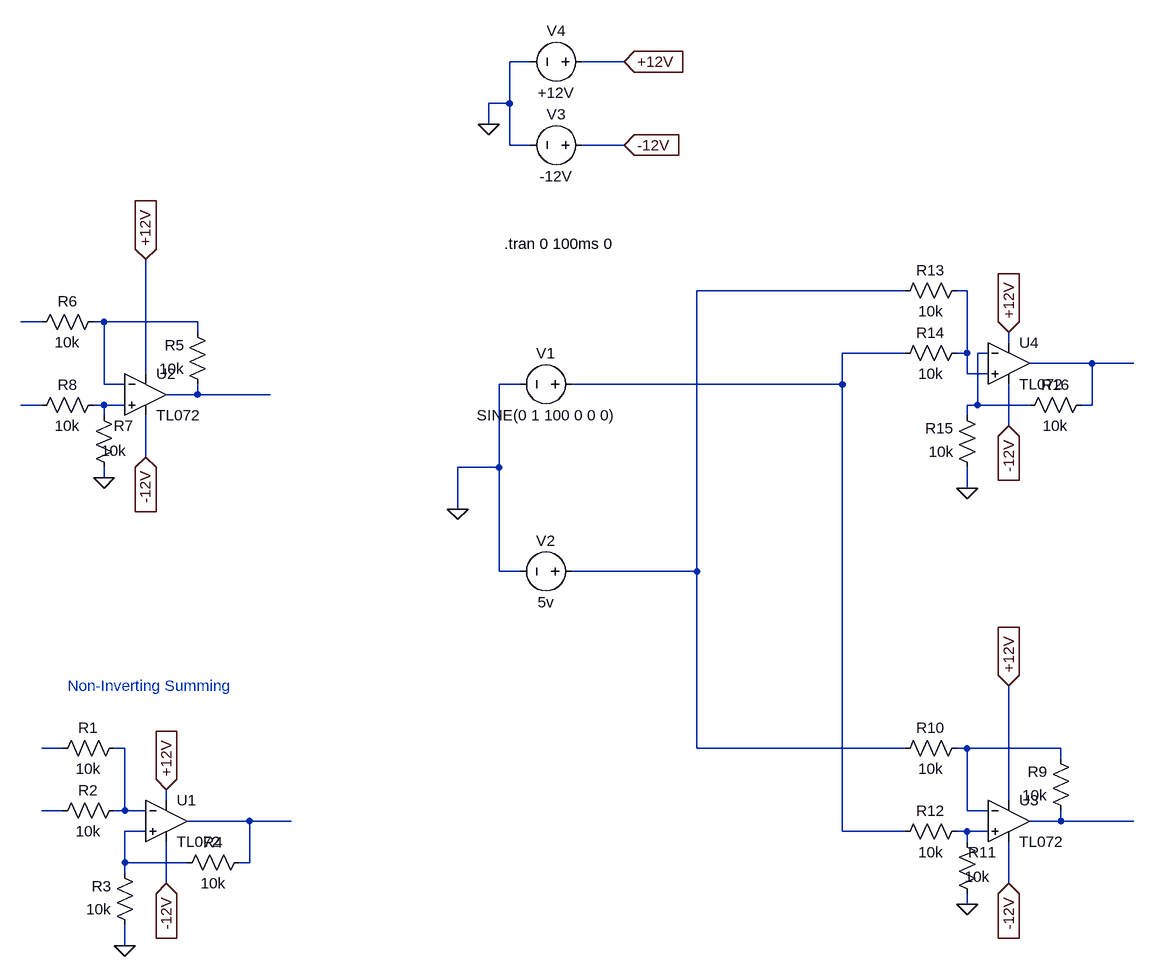
[diagram p0: schematic op-amp-patterns.asc]
op-amp-patterns.asc, the LTspice schematic file:
Version 4
SHEET 1 1412 680
WIRE 480 -960 448 -960
WIRE 624 -960 560 -960
WIRE 448 -896 448 -960
WIRE 448 -896 416 -896
WIRE 416 -864 416 -896
WIRE 448 -832 448 -896
WIRE 480 -832 448 -832
WIRE 624 -832 560 -832
WIRE 1056 -608 736 -608
WIRE 1152 -608 1136 -608
WIRE -272 -560 -304 -560
WIRE -176 -560 -192 -560
WIRE -32 -560 -176 -560
WIRE -32 -544 -32 -560
WIRE 1216 -528 1216 -544
WIRE 1056 -512 960 -512
WIRE 1152 -512 1152 -608
WIRE 1152 -512 1136 -512
WIRE 1184 -512 1168 -512
WIRE 1344 -496 1248 -496
WIRE 1408 -496 1344 -496
WIRE -112 -480 -112 -656
WIRE 1152 -480 1152 -512
WIRE 1184 -480 1152 -480
WIRE -176 -464 -176 -560
WIRE -144 -464 -176 -464
WIRE 464 -464 432 -464
WIRE 960 -464 960 -512
WIRE 960 -464 544 -464
WIRE -32 -448 -32 -464
WIRE -32 -448 -80 -448
WIRE 80 -448 -32 -448
WIRE -272 -432 -304 -432
WIRE -176 -432 -192 -432
WIRE -144 -432 -176 -432
WIRE 1168 -432 1168 -512
WIRE 1168 -432 1152 -432
WIRE 1248 -432 1168 -432
WIRE 1344 -432 1344 -496
WIRE 1344 -432 1328 -432
WIRE -176 -416 -176 -432
WIRE 1152 -416 1152 -432
WIRE 1216 -400 1216 -464
WIRE -112 -352 -112 -416
WIRE 432 -336 432 -464
WIRE 432 -336 368 -336
WIRE -176 -320 -176 -336
WIRE 1152 -304 1152 -336
WIRE 368 -272 368 -336
WIRE 432 -176 432 -336
WIRE 464 -176 432 -176
WIRE 736 -176 736 -608
WIRE 736 -176 544 -176
WIRE -240 96 -272 96
WIRE -144 96 -160 96
WIRE 736 96 736 -176
WIRE 1056 96 736 96
WIRE 1152 96 1136 96
WIRE 1296 96 1152 96
WIRE 1296 112 1296 96
WIRE -80 176 -80 160
WIRE 1216 176 1216 0
WIRE -240 192 -272 192
WIRE -144 192 -144 96
WIRE -144 192 -160 192
WIRE -112 192 -144 192
WIRE 1152 192 1152 96
WIRE 1184 192 1152 192
WIRE 48 208 -48 208
WIRE 112 208 48 208
WIRE 1296 208 1296 192
WIRE 1296 208 1248 208
WIRE 1408 208 1296 208
WIRE -112 224 -144 224
WIRE 960 224 960 -464
WIRE 1056 224 960 224
WIRE 1152 224 1136 224
WIRE 1184 224 1152 224
WIRE 1152 240 1152 224
WIRE -144 272 -144 224
WIRE -48 272 -144 272
WIRE 48 272 48 208
WIRE 48 272 32 272
WIRE -144 288 -144 272
WIRE -80 304 -80 240
WIRE 1216 304 1216 240
WIRE 1152 336 1152 320
WIRE -144 400 -144 368
FLAG -80 160 +12V
IOPIN -80 160 In
FLAG -80 304 -12V
IOPIN -80 304 In
FLAG -144 400 0
FLAG -112 -656 +12V
IOPIN -112 -656 In
FLAG -112 -352 -12V
IOPIN -112 -352 In
FLAG -176 -320 0
FLAG 1216 0 +12V
IOPIN 1216 0 In
FLAG 1216 304 -12V
IOPIN 1216 304 In
FLAG 1152 336 0
FLAG 1216 -544 +12V
IOPIN 1216 -544 In
FLAG 1216 -400 -12V
IOPIN 1216 -400 In
FLAG 1152 -304 0
FLAG 368 -272 0
FLAG 416 -864 0
FLAG 624 -960 +12V
IOPIN 624 -960 In
FLAG 624 -832 -12V
IOPIN 624 -832 In
SYMBOL OpAmps/TL072 -80 144 R0
SYMATTR InstName U1
SYMBOL Res -144 80 R90
WINDOW 0 0 56 VBottom 2
WINDOW 3 32 56 VTop 2
SYMATTR InstName R1
SYMATTR Value 10k
SYMBOL Res -144 176 R90
WINDOW 0 0 56 VBottom 2
WINDOW 3 32 56 VTop 2
SYMATTR InstName R2
SYMATTR Value 10k
SYMBOL res -128 384 R180
WINDOW 0 36 76 Left 2
WINDOW 3 36 40 Left 2
SYMATTR InstName R3
SYMATTR Value 10k
SYMBOL res 48 256 R90
WINDOW 0 0 56 VBottom 2
WINDOW 3 32 56 VTop 2
SYMATTR InstName R4
SYMATTR Value 10k
SYMBOL OpAmps/TL072 -112 -512 R0
SYMATTR InstName U2
SYMBOL res -16 -448 R180
WINDOW 0 36 76 Left 2
WINDOW 3 36 40 Left 2
SYMATTR InstName R5
SYMATTR Value 10k
SYMBOL res -176 -576 R90
WINDOW 0 0 56 VBottom 2
WINDOW 3 32 56 VTop 2
SYMATTR InstName R6
SYMATTR Value 10k
SYMBOL res -160 -320 R180
WINDOW 0 -30 80 Left 2
WINDOW 3 -19 42 Left 2
SYMATTR InstName R7
SYMATTR Value 10k
SYMBOL res -176 -448 R90
WINDOW 0 0 56 VBottom 2
WINDOW 3 32 56 VTop 2
SYMATTR InstName R8
SYMATTR Value 10k
SYMBOL OpAmps/TL072 1216 144 R0
SYMATTR InstName U3
SYMBOL res 1312 208 R180
WINDOW 0 36 76 Left 2
WINDOW 3 36 40 Left 2
SYMATTR InstName R9
SYMATTR Value 10k
SYMBOL res 1152 80 R90
WINDOW 0 0 56 VBottom 2
WINDOW 3 32 56 VTop 2
SYMATTR InstName R10
SYMATTR Value 10k
SYMBOL res 1168 336 R180
WINDOW 0 -30 80 Left 2
WINDOW 3 -19 42 Left 2
SYMATTR InstName R11
SYMATTR Value 10k
SYMBOL res 1152 208 R90
WINDOW 0 0 56 VBottom 2
WINDOW 3 32 56 VTop 2
SYMATTR InstName R12
SYMATTR Value 10k
SYMBOL OpAmps/TL072 1216 -560 R0
SYMATTR InstName U4
SYMBOL Res 1152 -624 R90
WINDOW 0 0 56 VBottom 2
WINDOW 3 32 56 VTop 2
SYMATTR InstName R13
SYMATTR Value 10k
SYMBOL Res 1152 -528 R90
WINDOW 0 0 56 VBottom 2
WINDOW 3 32 56 VTop 2
SYMATTR InstName R14
SYMATTR Value 10k
SYMBOL res 1168 -320 R180
WINDOW 0 36 76 Left 2
WINDOW 3 36 40 Left 2
SYMATTR InstName R15
SYMATTR Value 10k
SYMBOL res 1344 -448 R90
WINDOW 0 0 56 VBottom 2
WINDOW 3 32 56 VTop 2
SYMATTR InstName R16
SYMATTR Value 10k
SYMBOL voltage 560 -464 R90
WINDOW 0 -32 56 VBottom 2
WINDOW 3 32 56 VTop 2
SYMATTR InstName V1
SYMATTR Value SINE(0 1 100 0 0 0)
SYMBOL voltage 560 -176 R90
WINDOW 0 -32 56 VBottom 2
WINDOW 3 32 56 VTop 2
SYMATTR InstName V2
SYMATTR Value 5v
SYMBOL voltage 576 -832 R90
WINDOW 0 -32 56 VBottom 2
WINDOW 3 32 56 VTop 2
SYMATTR InstName V3
SYMATTR Value -12V
SYMBOL voltage 576 -960 R90
WINDOW 0 -32 56 VBottom 2
WINDOW 3 32 56 VTop 2
SYMATTR InstName V4
SYMATTR Value +12V
TEXT -232 0 Left 2 ;Non-Inverting Summing
TEXT 440 -680 Left 2 !.tran 0 100ms 0

The netlist it stands for:
* op-amp-patterns.asc
XU1 N017 N012 +12V -12V N015 TL072  ; pins In+ In- V+ V- OUT
R1 N012 N011 10k
R2 N012 N014 10k
R3 0 N017 10k
R4 N015 N017 10k
XU2 N010 N004 +12V -12V N008 TL072  ; pins In+ In- V+ V- OUT
R5 N008 N004 10k
R6 N004 N003 10k
R7 0 N010 10k
R8 N010 N009 10k
XU3 N018 N013 +12V -12V N016 TL072  ; pins In+ In- V+ V- OUT
R9 N016 N013 10k
R10 N013 N001 10k
R11 0 N018 10k
R12 N018 N005 10k
XU4 N002 N006 +12V -12V N007 TL072  ; pins In+ In- V+ V- OUT
R13 N002 N001 10k
R14 N002 N005 10k
R15 0 N006 10k
R16 N007 N006 10k
V1 N005 0 SINE(0 1 100 0 0 0)
V2 N001 0 5v
V3 -12V 0 -12V
V4 +12V 0 +12V
* Non-Inverting Summing
.tran 0 100ms 0
.backanno
.end